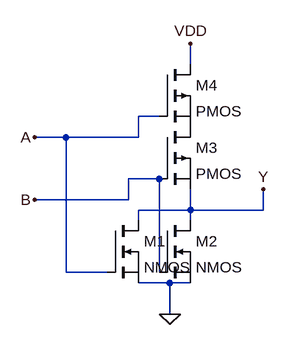
[diagram p0: schematic NOR.asc]
NOR.asc, the LTspice schematic file:
Version 4
SHEET 1 880 680
WIRE 336 96 336 64
WIRE 288 176 256 176
WIRE 144 208 96 208
WIRE 256 208 256 176
WIRE 256 208 144 208
WIRE 288 272 240 272
WIRE 240 304 240 272
WIRE 240 304 96 304
WIRE 336 320 336 288
WIRE 336 320 256 320
WIRE 448 320 448 288
WIRE 448 320 336 320
WIRE 256 336 256 320
WIRE 336 336 336 320
WIRE 144 416 144 208
WIRE 208 416 144 416
WIRE 288 416 288 272
WIRE 304 432 256 432
WIRE 336 432 304 432
WIRE 304 480 304 432
FLAG 304 480 0
FLAG 336 64 VDD
FLAG 448 288 Y
FLAG 96 208 A
FLAG 96 304 B
SYMBOL nmos 288 336 R0
SYMATTR InstName M2
SYMBOL pmos 288 192 R0
SYMATTR InstName M3
SYMBOL pmos 288 96 R0
SYMATTR InstName M4
SYMBOL nmos 208 336 R0
SYMATTR InstName M1

The netlist it stands for:
* NOR.asc
M2 Y B 0 0 NMOS
M3 P001 B Y Y PMOS
M4 VDD A P001 P001 PMOS
M1 Y A 0 0 NMOS
.model NMOS NMOS
.model PMOS PMOS
.lib standard.mos
.backanno
.end